# EAGLE schematic RemoteTx (EAGLE 7.2.0)
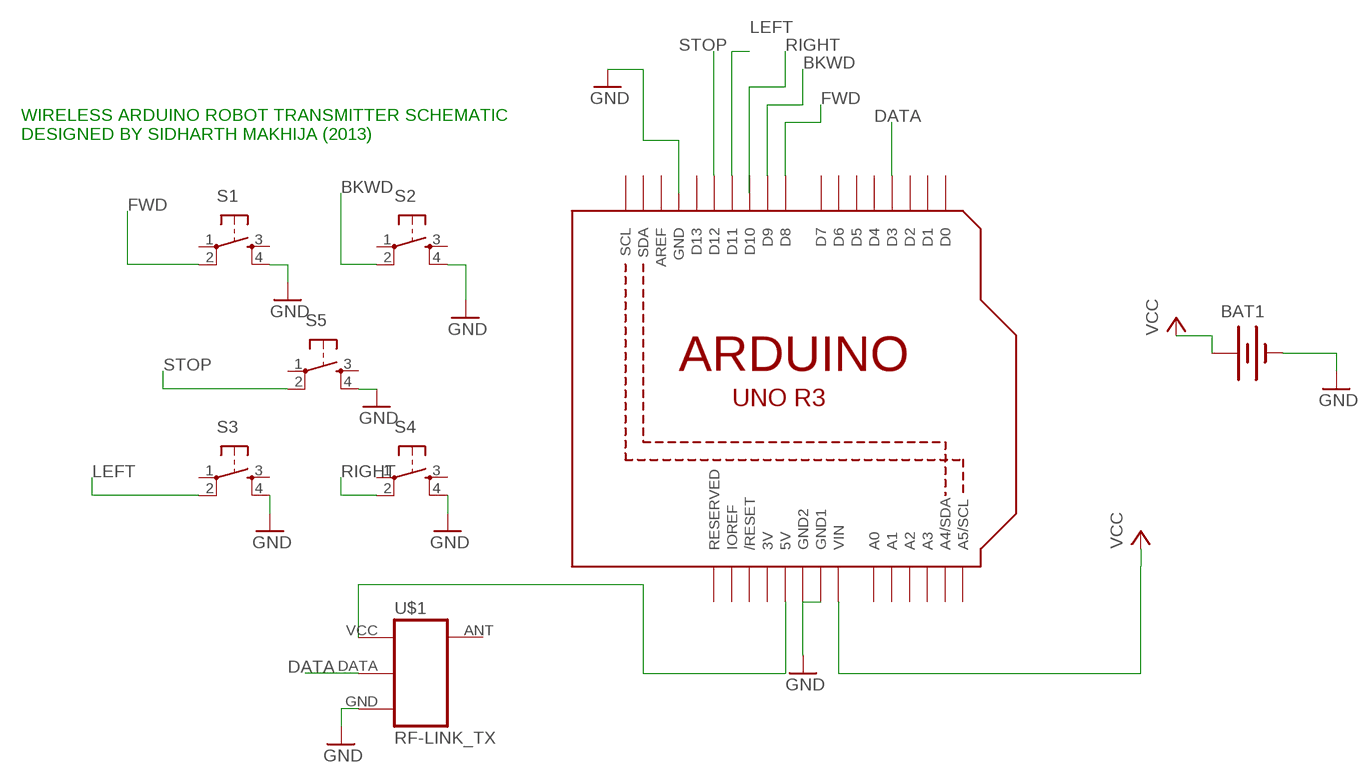
[diagram p0: schematic, sheet 1]

## Parts
BAT1  BATTERY9V  [BATTCON_9V]
S1  TAC_SWITCHPTH  [TACTILE-PTH]
S2  TAC_SWITCHPTH  [TACTILE-PTH]
S3  TAC_SWITCHPTH  [TACTILE-PTH]
S4  TAC_SWITCHPTH  [TACTILE-PTH]
S5  TAC_SWITCHPTH  [TACTILE-PTH]
U1  ARDUINOR3-DIMENSION  [ARDUINOR3]
U$1  RF-LINK_TX  [RF-LINK_TX]

## Nets
BKWD: S2.2 U1.D9
DATA: U1.D3 U$1.DATA
FWD: S1.2 U1.D8
GND: BAT1.- S1.4 S2.4 S3.4 S4.4 S5.4 U1.GND1 U1.GND2 U$1.GND
LEFT: S3.2 U1.D11
N$1: U1.5V U$1.VCC(+5V)
RIGHT: S4.2
STOP: S5.2 U1.D12
VCC: BAT1.+ U1.VIN
Unconnected: S1.1 S1.3 S2.1 S2.3 S3.1 S3.3 S4.1 S4.3 S5.1 S5.3 U1.A0 U1.A1 U1.A2 U1.A3 U1.A4(A4/SDA) U1.A5(A5/SCL) U1.AREF U1.D0 U1.D1 U1.D2 U1.D4 U1.D5 U1.D6 U1.D7 U1.D10 U1.D13 U1.IOREF U1.RESERVED U1.RESET(/RESET) U1.SCL U1.SDA U$1.ANT

## Notes on the sheet
- WIRELESS ARDUINO ROBOT TRANSMITTER SCHEMATIC
  DESIGNED BY SIDHARTH MAKHIJA (2013)

## Power pins joined to a net without a drawn wire
3V: U1.3V
GND: U1.GND

## Library data of the parts
BAT1 = SparkFun-Electromechanical:BATTERY: Battery Holders Various common sizes : AA, AAA, 18650 (PRT-12895), 20mm coin cell and 12mm coin cell. 20MM_4LEGS, BATT-10373
S1-S5 = SparkFun-Retired:TAC_SWITCH: Momentary Switch Button commonly used for reset or general input. Spark Fun Electronics SKU : COM-00097 SMT- SWCH-08247
U1 = adafruit:ARDUINOR3: This is a new object for the new Arduino R3 - with extra pins that you may want to use (such as IOref, and duplicated A4/A5
U$1 = SparkFun-RF:RF-LINK_TX: RF Link transmitters WRL-8945, 8946